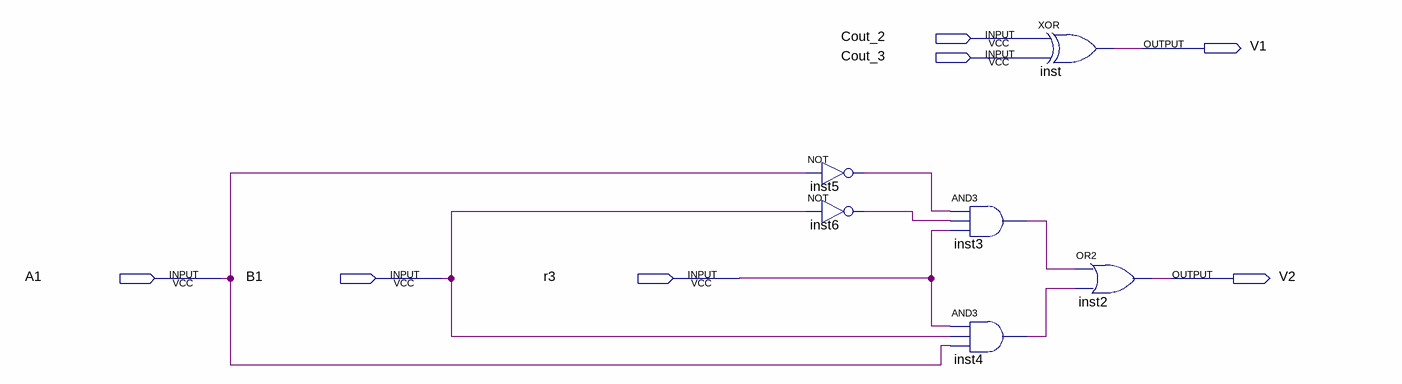
[diagram p0: schematic sheet]
// Quartus schematic vand_c2.bdf as structural Verilog: 6 symbols, 7 pins
module vand_c2 (
  input  Cout_2,
  input  Cout_3,
  input  A1,
  input  B1,
  input  r3,
  output V1,
  output V2
);

  wire inst3_out, inst4_out, inst5_out, inst6_out;

  not inst5 (inst5_out, A1);
  not inst6 (inst6_out, B1);
  and inst3 (inst3_out, inst5_out, inst6_out, r3);
  and inst4 (inst4_out, r3, B1, A1);
  xor inst (V1, Cout_2, Cout_3);
  or inst2 (V2, inst3_out, inst4_out);
endmodule
